# Altium schematic sheet 2016.SchDoc
size A4
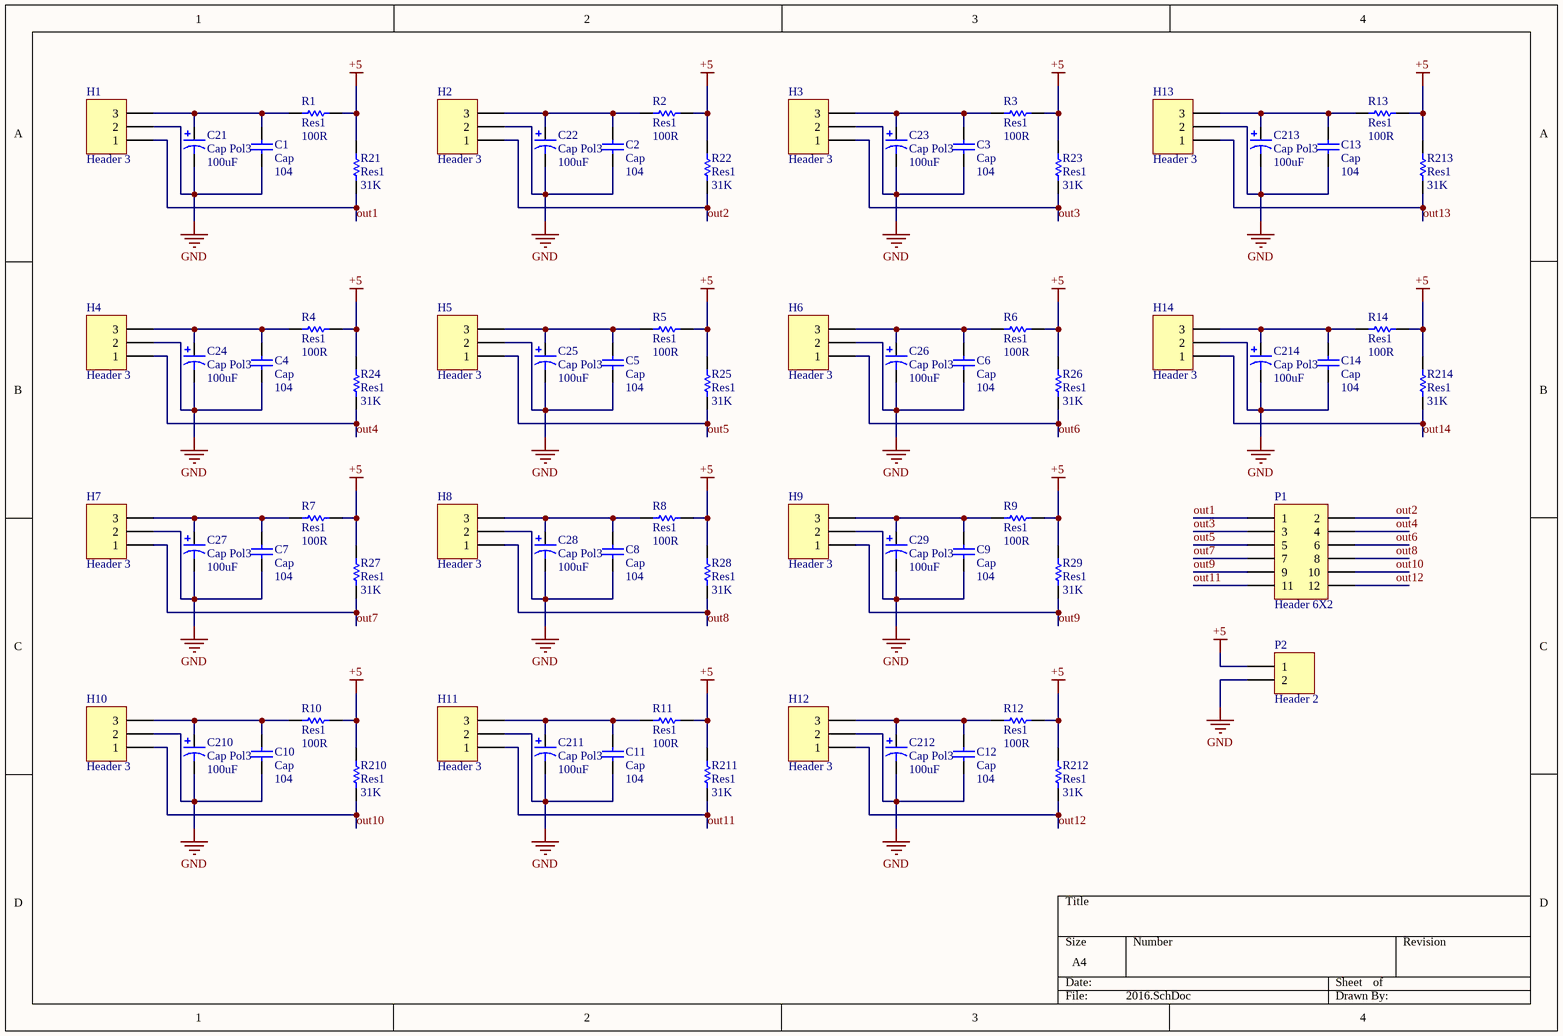
[diagram p0: 2016.SchDoc]

## Parts
C1  Cap  value 104  [0805C]
C2  Cap  value 104  [0805C]
C3  Cap  value 104  [0805C]
C4  Cap  value 104  [0805C]
C5  Cap  value 104  [0805C]
C6  Cap  value 104  [0805C]
C7  Cap  value 104  [0805C]
C8  Cap  value 104  [0805C]
C9  Cap  value 104  [0805C]
C10  Cap  value 104  [0805C]
C11  Cap  value 104  [0805C]
C12  Cap  value 104  [0805C]
C13  Cap  value 104  [0805C]
C14  Cap  value 104  [0805C]
C21  Cap Pol3  value 100uF  [0805C]
C22  Cap Pol3  value 100uF  [0805C]
C23  Cap Pol3  value 100uF  [0805C]
C24  Cap Pol3  value 100uF  [0805C]
C25  Cap Pol3  value 100uF  [0805C]
C26  Cap Pol3  value 100uF  [0805C]
C27  Cap Pol3  value 100uF  [0805C]
C28  Cap Pol3  value 100uF  [0805C]
C29  Cap Pol3  value 100uF  [0805C]
C210  Cap Pol3  value 100uF  [0805C]
C211  Cap Pol3  value 100uF  [0805C]
C212  Cap Pol3  value 100uF  [0805C]
C213  Cap Pol3  value 100uF  [0805C]
C214  Cap Pol3  value 100uF  [0805C]
H1  Header 3  [HDR1X3]
H2  Header 3  [HDR1X3]
H3  Header 3  [HDR1X3]
H4  Header 3  [HDR1X3]
H5  Header 3  [HDR1X3]
H6  Header 3  [HDR1X3]
H7  Header 3  [HDR1X3]
H8  Header 3  [HDR1X3]
H9  Header 3  [HDR1X3]
H10  Header 3  [HDR1X3]
H11  Header 3  [HDR1X3]
H12  Header 3  [HDR1X3]
H13  Header 3  [HDR1X3]
H14  Header 3  [HDR1X3]
P1  Header 6X2  [HDR2X6]
P2  Header 2  [HDR1X2]
R1  Res1  value 100R  [0805R]
R2  Res1  value 100R  [0805R]
R3  Res1  value 100R  [0805R]
R4  Res1  value 100R  [0805R]
R5  Res1  value 100R  [0805R]
R6  Res1  value 100R  [0805R]
R7  Res1  value 100R  [0805R]
R8  Res1  value 100R  [0805R]
R9  Res1  value 100R  [0805R]
R10  Res1  value 100R  [0805R]
R11  Res1  value 100R  [0805R]
R12  Res1  value 100R  [0805R]
R13  Res1  value 100R  [0805R]
R14  Res1  value 100R  [0805R]
R21  Res1  value 31K  [0805R]
R22  Res1  value 31K  [0805R]
R23  Res1  value 31K  [0805R]
R24  Res1  value 31K  [0805R]
R25  Res1  value 31K  [0805R]
R26  Res1  value 31K  [0805R]
R27  Res1  value 31K  [0805R]
R28  Res1  value 31K  [0805R]
R29  Res1  value 31K  [0805R]
R210  Res1  value 31K  [0805R]
R211  Res1  value 31K  [0805R]
R212  Res1  value 31K  [0805R]
R213  Res1  value 31K  [0805R]
R214  Res1  value 31K  [0805R]

## Nets
+5: P2.1 R1.2 R2.2 R3.2 R4.2 R5.2 R6.2 R7.2 R8.2 R9.2 R10.2 R11.2 R12.2 R13.2 R14.2 R21.2 R22.2 R23.2 R24.2 R25.2 R26.2 R27.2 R28.2 R29.2 R210.2 R211.2 R212.2 R213.2 R214.2
GND: C1.1 C2.1 C3.1 C4.1 C5.1 C6.1 C7.1 C8.1 C9.1 C10.1 C11.1 C12.1 C13.1 C14.1 C21.2 C22.2 C23.2 C24.2 C25.2 C26.2 C27.2 C28.2 C29.2 C210.2 C211.2 C212.2 C213.2 C214.2 H1.2 H2.2 H3.2 H4.2 H5.2 H6.2 H7.2 H8.2 H9.2 H10.2 H11.2 H12.2 H13.2 H14.2 P2.2
out1: H1.1 P1.1 R21.1
out2: H2.1 P1.2 R22.1
out3: H3.1 P1.3 R23.1
out4: H4.1 P1.4 R24.1
out5: H5.1 P1.5 R25.1
out6: H6.1 P1.6 R26.1
out7: H7.1 P1.7 R27.1
out8: H8.1 P1.8 R28.1
out9: H9.1 P1.9 R29.1
out10: H10.1 P1.10 R210.1
out11: H11.1 P1.11 R211.1
out12: H12.1 P1.12 R212.1
out13: H13.1 R213.1
out14: H14.1 R214.1
NetC1_2: C1.2 C21.1 H1.3 R1.1
NetC2_2: C2.2 C22.1 H2.3 R2.1
NetC3_2: C3.2 C23.1 H3.3 R3.1
NetC4_2: C4.2 C24.1 H4.3 R4.1
NetC5_2: C5.2 C25.1 H5.3 R5.1
NetC6_2: C6.2 C26.1 H6.3 R6.1
NetC7_2: C7.2 C27.1 H7.3 R7.1
NetC8_2: C8.2 C28.1 H8.3 R8.1
NetC9_2: C9.2 C29.1 H9.3 R9.1
NetC10_2: C10.2 C210.1 H10.3 R10.1
NetC11_2: C11.2 C211.1 H11.3 R11.1
NetC12_2: C12.2 C212.1 H12.3 R12.1
NetC13_2: C13.2 C213.1 H13.3 R13.1
NetC14_2: C14.2 C214.1 H14.3 R14.1

## Library data of the parts
C1-C14 = Cap: Capacitor; Published: 8-Jun-2000; LatestRevisionDate: 17-Jul-2002; LatestRevisionNote: Re-released for DXP Platform.; PackageReference: RAD-0.3; Publisher: Altium Limited; PackageDescription: Radial Cap, Thru-Hole; 2 Leads; 0.3 in Pin Spacing
C21-C29 C210-C214 = Cap Pol3: Polarized Capacitor (Surface Mount); Published: 8-Jun-2000; LatestRevisionDate: 29-May-2009; LatestRevisionNote: IPC-7351 Footprint Added.; PackageReference: C0805; Publisher: Altium Limited; PackageDescription: Chip Capacitor
H1-H14 = Header 3: Header, 3-Pin; LatestRevisionDate: 17-Jul-2002; LatestRevisionNote: Re-released for DXP Platform.; Publisher: Altium Limited
P1 = Header 6X2: Header, 6-Pin, Dual row; LatestRevisionDate: 17-Jul-2002; LatestRevisionNote: Re-released for DXP Platform.; Publisher: Altium Limited
P2 = Header 2: Header, 2-Pin; LatestRevisionDate: 17-Jul-2002; LatestRevisionNote: Re-released for DXP Platform.; Publisher: Altium Limited
R1-R14 R21-R29 R210-R214 = Res1: Resistor; Published: 8-Jun-2000; LatestRevisionDate: 17-Jul-2002; LatestRevisionNote: Re-released for DXP Platform.; PackageReference: AXIAL-0.3; Publisher: Altium Limited; PackageDescription: Axial Device, Thru-Hole; 2 Leads; 0.3 in Pin Spacing